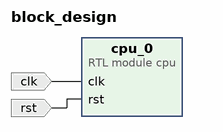
[diagram p0: block diagram of the top level]
# Vivado block design block_design, xc7a35tcpg236-1, Vivado 2022.1
create_bd_design block_design

create_bd_port -dir I -type clk clk
set_property -dict {CONFIG.FREQ_HZ 100000000} [get_bd_ports clk]
create_bd_port -dir I -type rst rst

create_bd_cell -type module -reference cpu cpu_0

# ---- connections ----

connect_bd_net [get_bd_ports clk] [get_bd_pins cpu_0/clk]
connect_bd_net [get_bd_ports rst] [get_bd_pins cpu_0/rst]

validate_bd_design
save_bd_design
